# Altium schematic sheet EG8010.SchDoc: =DocumentName
size A4; CompanyName: "AS Manufacturing" LLC; Organization: "AS Manufacturing" LLC; Address1: 5 Sklyarenka St.; Address2: Kyiv 04073; Address3: Ukraine; Address4: https://ajax.systems/en/; SheetNumber: 1; SheetTotal: 1; Template_version: 1.0.1
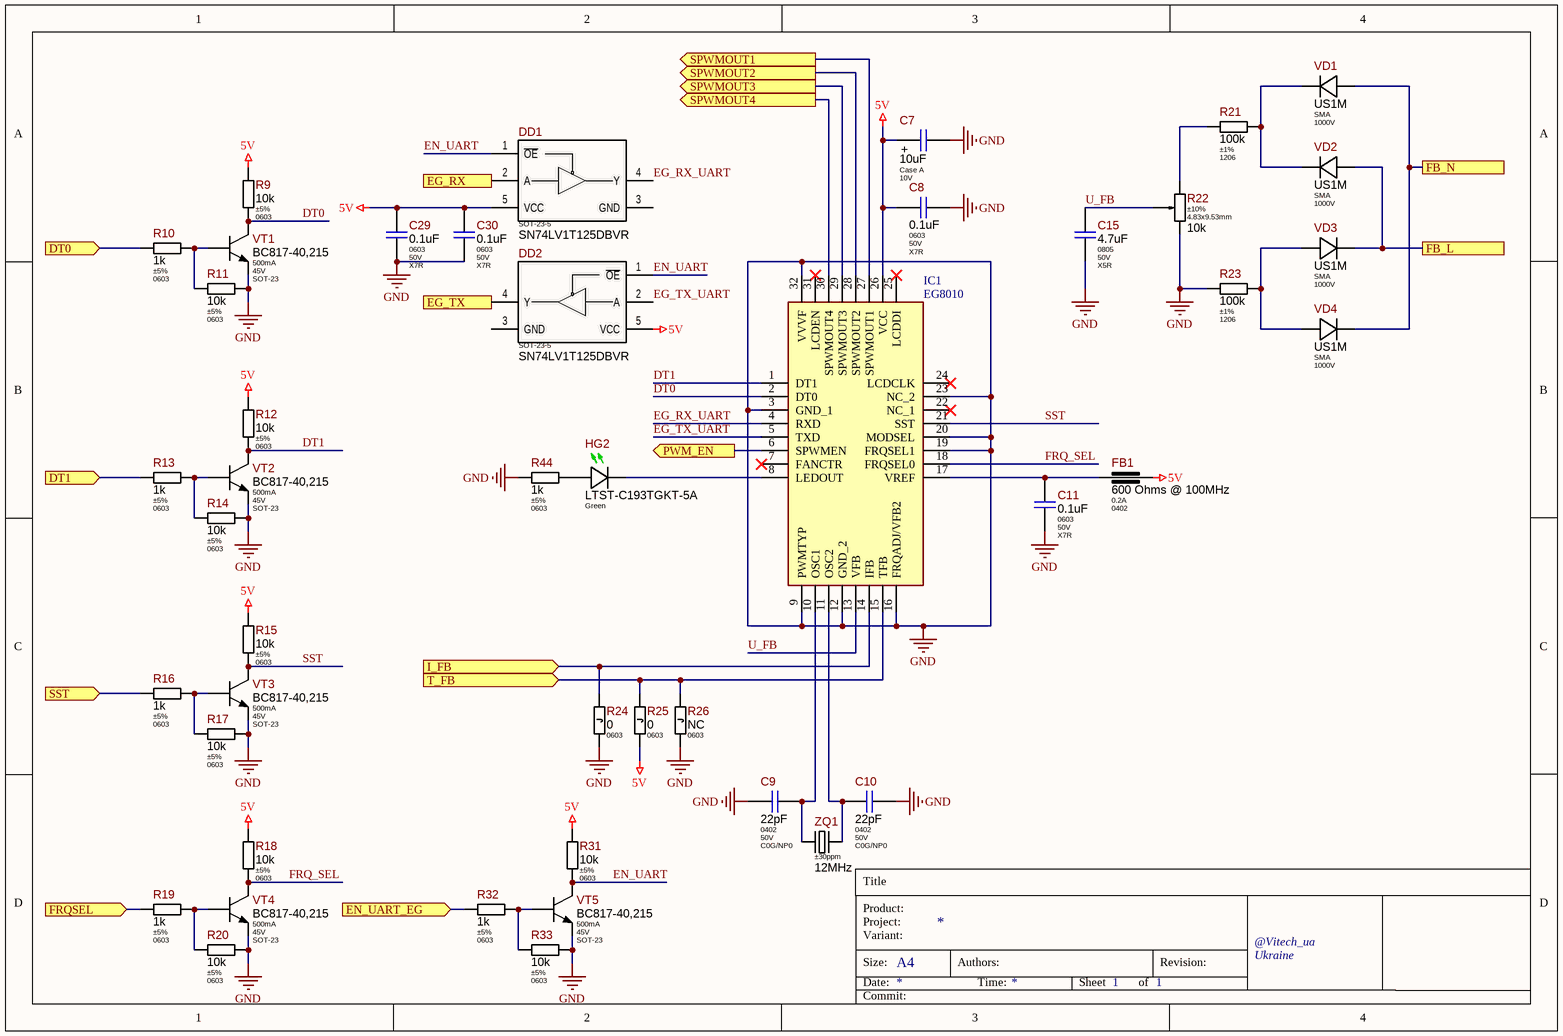
[diagram p0: EG8010.SchDoc]

## Parts
C7  Package: Case A  Voltage: 10V  [C_TANTAL_CASE_A_MED]  (hidden comment: 10uF)
C8  Package: 0603  Voltage: 50V  Dielectric Type: X7R  [C_CERAMIC_0603_MED]  (hidden comment: 0.1uF)
C9  Package: 0402  Voltage: 50V  Dielectric Type: C0G/NP0  [C_CERAMIC_0402_MED]  (hidden comment: 22pF)
C10  Package: 0402  Voltage: 50V  Dielectric Type: C0G/NP0  [C_CERAMIC_0402_MED]  (hidden comment: 22pF)
C11  Package: 0603  Voltage: 50V  Dielectric Type: X7R  [C_CERAMIC_0603_MED]  (hidden comment: 0.1uF)
C15  Package: 0805  Voltage: 50V  Dielectric Type: X5R  [C_CERAMIC_0805_MED]  (hidden comment: 4.7uF)
C29  Package: 0603  Voltage: 50V  Dielectric Type: X7R  [C_CERAMIC_0603_MED]  (hidden comment: 0.1uF)
C30  Package: 0603  Voltage: 50V  Dielectric Type: X7R  [C_CERAMIC_0603_MED]  (hidden comment: 0.1uF)
DD1  SN74LV1T125DBVR  [SOT-23-5]
DD2  SN74LV1T125DBVR  [SOT-23-5]
FB1  value 600 Ohms @ 100MHz  Current: 0.2A  Package: 0402  [BLM15xxxxxSN1x_MED]  (hidden comment: BLM15BD601SN1D)
HG2  Color: Green  [LTST-C193xGKT-5A]  (hidden comment: LTST-C193TGKT-5A)
IC1  EG8010  [QFP80P900X900X160-32N]
R9  Tolerance: ±5%  Package: 0603  [R_ANY_CHIP_0603_MED]  (hidden comment: 10k)
R10  Tolerance: ±5%  Package: 0603  [R_ANY_CHIP_0603_MED]  (hidden comment: 1k)
R11  Tolerance: ±5%  Package: 0603  [R_ANY_CHIP_0603_MED]  (hidden comment: 10k)
R12  Tolerance: ±5%  Package: 0603  [R_ANY_CHIP_0603_MED]  (hidden comment: 10k)
R13  Tolerance: ±5%  Package: 0603  [R_ANY_CHIP_0603_MED]  (hidden comment: 1k)
R14  Tolerance: ±5%  Package: 0603  [R_ANY_CHIP_0603_MED]  (hidden comment: 10k)
R15  Tolerance: ±5%  Package: 0603  [R_ANY_CHIP_0603_MED]  (hidden comment: 10k)
R16  Tolerance: ±5%  Package: 0603  [R_ANY_CHIP_0603_MED]  (hidden comment: 1k)
R17  Tolerance: ±5%  Package: 0603  [R_ANY_CHIP_0603_MED]  (hidden comment: 10k)
R18  Tolerance: ±5%  Package: 0603  [R_ANY_CHIP_0603_MED]  (hidden comment: 10k)
R19  Tolerance: ±5%  Package: 0603  [R_ANY_CHIP_0603_MED]  (hidden comment: 1k)
R20  Tolerance: ±5%  Package: 0603  [R_ANY_CHIP_0603_MED]  (hidden comment: 10k)
R21  Tolerance: ±1%  Package: 1206  [R_ANY_CHIP_1206_MED]  (hidden comment: 100k)
R22  Tolerance: ±10%  Package: 4.83x9.53mm  [3296W-1-xxx]  (hidden comment: 10k)
R23  Tolerance: ±1%  Package: 1206  [R_ANY_CHIP_1206_MED]  (hidden comment: 100k)
R24  Package: 0603  [R_ANY_CHIP_0603_MED]  (hidden comment: 0)
R25  Package: 0603  [R_ANY_CHIP_0603_MED]  (hidden comment: 0)
R26  Package: 0603  [R_ANY_CHIP_0603_MED]  (hidden comment: NC)
R31  Tolerance: ±5%  Package: 0603  [R_ANY_CHIP_0603_MED]  (hidden comment: 10k)
R32  Tolerance: ±5%  Package: 0603  [R_ANY_CHIP_0603_MED]  (hidden comment: 1k)
R33  Tolerance: ±5%  Package: 0603  [R_ANY_CHIP_0603_MED]  (hidden comment: 10k)
R44  Tolerance: ±5%  Package: 0603  [R_ANY_CHIP_0603_MED]  (hidden comment: 1k)
VD1  Package: SMA  Voltage: 1000V  [SMA_MED]  (hidden comment: US1M)
VD2  Package: SMA  Voltage: 1000V  [SMA_MED]  (hidden comment: US1M)
VD3  Package: SMA  Voltage: 1000V  [SMA_MED]  (hidden comment: US1M)
VD4  Package: SMA  Voltage: 1000V  [SMA_MED]  (hidden comment: US1M)
VT1  Ic: 500mA  Vce: 45V  Package: SOT-23  [SOT-23_MED]  (hidden comment: BC817-40,215)
VT2  Ic: 500mA  Vce: 45V  Package: SOT-23  [SOT-23_MED]  (hidden comment: BC817-40,215)
VT3  Ic: 500mA  Vce: 45V  Package: SOT-23  [SOT-23_MED]  (hidden comment: BC817-40,215)
VT4  Ic: 500mA  Vce: 45V  Package: SOT-23  [SOT-23_MED]  (hidden comment: BC817-40,215)
VT5  Ic: 500mA  Vce: 45V  Package: SOT-23  [SOT-23_MED]  (hidden comment: BC817-40,215)
ZQ1  Frequency Tolerance: ±30ppm  Frequency: 12MHz  [CSM4-Series]  (hidden comment: CSM4Z-A2B3C3-40-12.0D18)

## Ports
DT0 (in), DT1 (in), EG_RX (in), EG_TX (out), EN_UART_EG (in), FB_L, FB_N, FRQSEL (in), I_FB (in), PWM_EN (out), SPWMOUT1 (out), SPWMOUT2 (out), SPWMOUT3 (out), SPWMOUT4 (out), SST (in), T_FB (in)

## Nets
5V: C7.1 C8.1 C29.2 C30.2 DD1.5(VCC) DD2.5(VCC) FB1.1 IC1.26(VCC) R9.2 R12.2 R15.2 R18.2 R25.2 R31.2
GND: C7.2 C8.2 C9.1 C10.2 C11.2 C15.2 C29.1 C30.1 IC1.3(GND_1) IC1.9(PWMTYP) IC1.12(GND_2) IC1.16(FRQADJ/VFB2) IC1.19(FRQSEL1) IC1.20(MODSEL) IC1.23(NC_2) IC1.32(VVVF) R11.1 R14.1 R17.1 R20.1 R22.1(CCW) R23.1 R24.2 R26.2 R33.1 R44.1 VT1.2(E) VT2.2(E) VT3.2(E) VT4.2(E) VT5.2(E)
DT0: IC1.2(DT0) R9.1 VT1.3(C)
DT0: R10.1 ; port DT0  [a separate net that carries the same name]
DT1: IC1.1(DT1) R12.1 VT2.3(C)
DT1: R13.1 ; port DT1  [a separate net that carries the same name]
EG_RX: DD1.2(A) ; port EG_RX
EG_RX_UART: DD1.4(Y) IC1.4(RXD)
EG_TX: DD2.4(Y) ; port EG_TX
EG_TX_UART: DD2.2(A) IC1.5(TXD)
EN_UART: DD1.1(~{OE}) DD2.1(~{OE}) R31.1 VT5.3(C)
EN_UART_EG: R32.1 ; port EN_UART_EG
FB_L: VD2.AN VD3.CA ; port FB_L
FB_N: VD1.AN VD4.CA ; port FB_N
FRQ_SEL: IC1.18(FRQSEL0) R18.1 VT4.3(C)
FRQSEL: R19.1 ; port FRQSEL
I_FB: IC1.14(IFB) R24.1 ; port I_FB
PWM_EN: IC1.6(SPWMEN) ; port PWM_EN
SPWMOUT1: IC1.27(SPWMOUT1) ; port SPWMOUT1
SPWMOUT2: IC1.28(SPWMOUT2) ; port SPWMOUT2
SPWMOUT3: IC1.29(SPWMOUT3) ; port SPWMOUT3
SPWMOUT4: IC1.30(SPWMOUT4) ; port SPWMOUT4
SST: IC1.21(SST) R15.1 VT3.3(C)
SST: R16.1 ; port SST  [a separate net that carries the same name]
T_FB: IC1.15(TFB) R25.1 R26.1 ; port T_FB
U_FB: C15.1 IC1.13(VFB) R22.2(WIPER)
NetC9_2: C9.2 IC1.10(OSC1) ZQ1.2(XTAL2)
NetC10_1: C10.1 IC1.11(OSC2) ZQ1.1(XTAL1)
NetC11_1: C11.1 FB1.2 IC1.17(VREF)
NetHG2_AN: HG2.AN(Anode) R44.2
NetHG2_CA: HG2.CA(Cathode) IC1.8(LEDOUT)
NetR10_2: R10.2 R11.2 VT1.1(B)
NetR13_2: R13.2 R14.2 VT2.1(B)
NetR16_2: R16.2 R17.2 VT3.1(B)
NetR19_2: R19.2 R20.2 VT4.1(B)
NetR21_1: R21.1 R22.3(CW)
NetR21_2: R21.2 VD1.CA VD2.CA
NetR23_2: R23.2 VD3.AN VD4.AN
NetR32_2: R32.2 R33.2 VT5.1(B)

Not connected (* = marked no-connect by the designer): DD1 3(GND); DD2 3(GND); IC1 7(FANCTR)* 22(NC_1)* 24(LCDCLK)* 25(LCDDI)* 31(LCDEN)*

## Notes on the sheet
- Title
- Product:
- Project:
- Size:
- Date:
- Variant:
- A4
- Authors:
- Time:
- Sheet
- of
- Revision:
- @Vitech_ua
- Commit:
- (in symbol 293D106X9010A2TE3) +

## Library data of the parts
C7 = 293D106X9010A2TE3: 10uF 10V ±10% Case A Tantalum Capacitor RoHS, 3.4Ohm; Manufacturer: Vishay; Ajax_1C_ID: 58999; Ajax_1C_PN: 10uF 10V case A Vishay 293D106X9010A2TE3 Tantalum Capacitor SMD RoHS; Ajax_1С_Status: RND Only; Standard Lead Time: 20 Weeks; Component Status: Released; Dielectric Type: NONE; GUID_1C: 304cf5a9-8da3-11ed-a366-005056994834; Value: 10uF; Part Number: 293D106X9010A2TE3; Part Type: Tantalum; Component Type: SMD; Temperature Range: -55°C ~ 125°C; Tolerance: ±10%; ComponentLink1URL: https://eu.mouser.com/datasheet/2/427/293d-1763499.pdf; Supplier 1: Mouser; Supplier Part Number 1: 74-293D106X9010A2TE3; Replacement: NONE; Price: 0,1; ComponentLink1Description: Datasheet
C8 C11 C29 C30 = CL10B104KB8NNND: 100nF 50V X7R ±10% 0603 Ceramic Capacitor RoHS; Manufacturer: Samsung Electro-Mechanics; Ajax_1C_ID: 21313; Ajax_1C_PN: 100nF 50V X7R 10% 0603 CL10B104KB8NNND ceramic capacitor SMD; Ajax_1С_Status: Substitution; Standard Lead Time: 18 Weeks; Component Status: Released; Replacement: CL10B104KB8NNNC; GUID_1C: f1fd6399-ca68-11ea-ab63-0050569f2651; Value: 0.1uF; Part Number: CL10B104KB8NNND; Part Type: Ceramic / X7R / 0603; Component Type: SMD; Temperature Range: -55°C ~ 125°C; Tolerance: ±10%; ComponentLink1URL: https://media.digikey.com/pdf/Data%20Sheets/Samsung%20PDFs/CL_Series_MLCC_ds.pdf; Supplier 1: Digi-Key; Supplier Part Number 1: CL10B104KB8NNND-ND; Price: 0,0039378; ComponentLink1Description: Datasheet
C9 C10 = CL05C220JB5NNNC: 22pF 50V NP0, C0G ±5% 0402 Ceramic Capacitor RoHS; Manufacturer: Samsung Electro-Mechanics; Ajax_1C_ID: 26744; Ajax_1C_PN: 22pF 50V COG 5% 0402 Samsung CL05C220JB5NNNC Ceramic Capacitor SMD RoHS; Ajax_1С_Status: Substitution; Standard Lead Time: 22 Weeks; Component Status: Released; Replacement: NONE; GUID_1C: 5b73e2ce-71ce-11eb-ab70-0050569f2651; Value: 22pF; Part Number: CL05C220JB5NNNC; Part Type: Ceramic / C0G(NP0) / 0402; Component Type: SMD; Temperature Range: -55°C ~ 125°C; Tolerance: ±5%; ComponentLink1URL: https://media.digikey.com/pdf/Data%20Sheets/Samsung%20PDFs/CL_Series_MLCC_ds.pdf; Supplier 1: Digi-Key; Supplier Part Number 1: 1276-1116-2-ND; Price: 0,0034; ComponentLink1Description: Datasheet
C15 = GRM21BR61H475KE51L: 4.7uF 50V X5R ±10% 0805 Ceramic Capacitor RoHS; Manufacturer: Murata Electronics; Ajax_1C_ID: 10966; Ajax_1C_PN: 4.7uF 50V X5R 10% 0805 GRM21BR61H475KE51L/CL21A475KBQNNNE Ceramic Capacitor SMD RoHS; Ajax_1С_Status: Mass Production; Standard Lead Time: 15 Weeks; Component Status: Released; Replacement: NONE; GUID_1C: c30c0b00-b370-11e7-8189-14dda9d2d04d; Value: 4.7uF; Part Number: GRM21BR61H475KE51L; Part Type: Ceramic / X5R / 0805; Component Type: SMD; Temperature Range: -55°C ~ 85°C; Tolerance: ±10%; ComponentLink1URL: https://search.murata.co.jp/Ceramy/image/img/A01X/G101/ENG/GRM21BR61H475KE51-01.pdf; Supplier 1: Digi-Key; Supplier Part Number 1: 490-10751-2-ND; Price: 0,0396; ComponentLink1Description: Datasheet
DD1 DD2 = SN74LV1T125DBVR: Single Power Supply Single Buffer Gate with 3-State Output CMOS Logic Level Shifter, SOT-23-5; Manufacturer: Texas Instruments; Ajax_1C_ID: 37412; Ajax_1C_PN: SN74LV1T125DBVRG4 микросхема SOT-23-5 TI; Ajax_1С_Status: RND Only; Standard Lead Time: 35 Weeks; Component Status: On Review; Replacement: NONE; GUID_1C: 2979ae79-574b-11ec-a356-005056994834; Package: SOT-23-5; Part Number: SN74LV1T125DBVR; Part Type: Logic / Level Translator; Component Type: SMD; Temperature Range: -40°C ~ 125°C; ComponentLink1URL: https://www.ti.com/lit/ds/symlink/sn74lv1t125.pdf; Supplier 1: Digi-Key; Supplier Part Number 1: 296-37172-2-ND; Price: 0,386; ComponentLink1Description: Datasheet
FB1 = BLM15BD601SN1D: 600 Ohms @ 100MHz Power Line Ferrite Bead 0402, 200mA 650mOhm; Manufacturer: Murata Electronics; Ajax_1C_ID: 50383; Ajax_1C_PN: 600R BLM15BD601SN1D 0402 Murata Ferrite Bead; Ajax_1С_Status: RND Only; Saturation Current: NONE; Tolerance: ±25%; Component Status: Released; Standard Lead Time: 26 Weeks; GUID_1C: 598dd509-398f-11ed-a363-005056994834; Part Number: BLM15BD601SN1D; Part Type: Ferrite Bead; Component Type: SMD; Temperature Range: -55°C ~ 125°C; ComponentLink1URL: https://eu.mouser.com/datasheet/2/281/ENFA0018-1915754.pdf; Supplier 1: Mouser; Supplier Part Number 1: 81-BLM15BD601SN1D; Replacement: NONE; Price: 0,05; ComponentLink1Description: Datasheet
HG2 = LTST-C193TGKT-5A: Indication LED, Green 525nm, Clear, SMD 0603, Vf 2.5V - 3.1V, 28 ~ 280mcd @ 5 mA, 130°; Manufacturer: Lite-On Optoelectronics; Ajax_1C_ID: 10369; Ajax_1C_PN: LTST-C193TGKT-5A Green SMD LED 0603 12mcd 5mA 130deg RoHS pcs; Ajax_1С_Status: Mass Production; Component Status: Released; Replacement: NONE; GUID_1C: 4b87c4c2-6263-11e7-811b-14dda9d2d04d; Part Number: LTST-C193TGKT-5A; Part Type: LED / 0603; Component Type: SMD; Package: 0603; Wavelength: 525nm; Temperature Range: -20°C ~ 80°C; ComponentLink1URL: https://media.digikey.com/pdf/Data%20Sheets/Lite-On%20PDFs/LTST-C193TGKT-5A.pdf; Supplier 1: Digi-Key; Supplier Part Number 1: 160-1832-2-ND; Price: 0,10177143; ComponentLink1Description: Datasheet
IC1 = EG8010: Integrated Circuit; Manufacturer_Name: Glenair; Datasheet Link: https://datasheetspdf.com/pdf-file/729849/EGMicro/EG8010/1; Height: 1.6mm; Manufacturer_Part_Number: EG8010
R9 R11 R12 R14 R15 R17 R18 R20 R31 R33 = RC0603JR-0710KL: 10 kOhms ±5%, 1/10W 0603 Thick Film Resistor; Manufacturer: Yageo; Ajax_1C_ID: 2860; Ajax_1C_PN: 10k 5% 0603 Resistors SMD RoHS; Ajax_1С_Status: Mass Production; Power Rating: 0.1W; Voltage: 75V; Component Status: Released; Temperature Stability: ±100ppm/°C; Replacement: NONE; GUID_1C: df4c2852-e567-11e2-9779-6c626deda1bb; Value: 10k; Part Number: RC0603JR-0710KL; Component Type: SMD; Part Type: Thick Film; Temperature Range: -55°C ~ 155°C; ComponentLink1URL: https://eu.mouser.com/datasheet/2/447/PYu_RC_Group_51_RoHS_L_10-1664068.pdf; Supplier 1: Digi-Key; Supplier Part Number 1: 311-10KGRTR-ND; Price: 0,0006; ComponentLink1Description: Datasheet
R10 R13 R16 R19 R32 R44 = RC0603JR-071KL: 1 kOhms ±5%, 1/10W 0603 Thick Film Resistor; Manufacturer: Yageo; Ajax_1C_ID: 28124; Ajax_1C_PN: 1k 5% 0603 Resistors SMD RoHS; Ajax_1С_Status: Mass Production; Power Rating: 0.1W; Voltage: 75V; Component Status: Released; Temperature Stability: ±100ppm/°C; Replacement: NONE; GUID_1C: fbc5fd6b-8d66-11eb-ab70-0050569f2651; Value: 1k; Part Number: RC0603JR-071KL; Component Type: SMD; Part Type: Thick Film; Temperature Range: -55°C ~ 155°C; ComponentLink1URL: https://eu.mouser.com/datasheet/2/447/PYu_RC_Group_51_RoHS_L_11-1984063.pdf; Supplier 1: Digi-Key; Supplier Part Number 1: 311-1.0KGRTR-ND; Price: 0,00072; ComponentLink1Description: Datasheet
R21 R23 = RC1206FR-07100KL: 100 kOhms ±1%, 1/4W 1206 Thick Film Resistor; Manufacturer: Yageo; Ajax_1C_ID: 14373; Ajax_1C_PN: 100k 1% 1206 Resistors SMD RoHS; Ajax_1С_Status: Mass Production; Power Rating: 0.25W; Voltage: 200V; Component Status: Released; Temperature Stability: ±100ppm/°C; Replacement: NONE; GUID_1C: 93b23056-f3fc-11e8-ab4c-0050569f2651; Value: 100k; Part Number: RC1206FR-07100KL; Component Type: SMD; Part Type: Thick Film; Temperature Range: -55°C ~ 155°C; ComponentLink1URL: https://eu.mouser.com/datasheet/2/447/PYu_RC_Group_51_RoHS_L_10-1664068.pdf; Supplier 1: Digi-Key; Supplier Part Number 1: 311-100KFRTR-ND; Price: 0,00288; ComponentLink1Description: Datasheet
R22 = 3296W-1-103LF: 10 kOhms ±10% Trimmer Resistor, 0.5W, Through Hole 3/8", 4.83x9.53mm, 10.03mm Height; Manufacturer: Bourns; Ajax_1C_PN: NONE; Ajax_1С_Status: RND Only; Component Status: On Review; Temperature Stability: ±100ppm/°C; Value: 10k; Part Number: 3296W-1-103LF; Component Type: PTH; Part Type: Trimming Potentiometer; Power Rating: 0.5W; Temperature Range: -55°C ~ 125°C; ComponentLink1URL: https://www.bourns.com/data/global/pdfs/3296.pdf; Supplier 1: Mouser; Supplier Part Number 1: 652-3296W-1-103LF; Replacement: NONE; Price: NONE; ComponentLink1Description: Datasheet
R24-R26 = RC0603JR-070RL: 0 Ohms Jumper, 1/10W 0603 Thick Film Resistor; Manufacturer: Yageo; Tolerance: ±5%; Ajax_1C_ID: 2857; Ajax_1C_PN: 0R 5% 0603 Resistors SMD RoHS; Ajax_1С_Status: Mass Production; Power Rating: 0.1W; Voltage: 75V; Component Status: Released; Temperature Stability: NONE; GUID_1C: df4c284c-e567-11e2-9779-6c626deda1bb; Part Number: RC0603JR-070RL; Component Type: SMD; Part Type: Thick Film; Temperature Range: -55°C ~ 155°C; ComponentLink1URL: https://eu.mouser.com/datasheet/2/447/PYu_RC_Group_51_RoHS_L_10-1664068.pdf; Supplier 1: Digi-Key; Supplier Part Number 1: 311-0.0GRTR-ND; Replacement: NONE; Price: 0,0006; ComponentLink1Description: Datasheet
  R24 R25: Value: 0
  R26: Value: NC
VD1-VD4 = US1M: Diode Standard 1000V 1A, 75ns, SMA; Manufacturer: Diodec Semiconductor; Ajax_1C_ID: 20461; Ajax_1C_PN: US1M-DIO 1.0A 1000V 75ns, диод; Ajax_1С_Status: Mass Production; Component Status: Released; Vf: 1.7V @ 1A; Replacement: NONE; GUID_1C: 3d137b04-96a6-11ea-ab61-0050569f2651; Part Number: US1M; Part Type: General; Component Type: SMD; Marking: US1M; Current: 1A; Temperature Range: -50°C ~ 150°C; ComponentLink1URL: https://diotec.com/request/datasheet/us1a.pdf; Supplier 1: Arrow; Supplier Part Number 1: US1M; Price: 0,02875902; ComponentLink1Description: Datasheet
VT1-VT5 = BC817-40,215: 45V, 500mA NPN General Purpose Transistor; Manufacturer: Nexperia USA; Ajax_1C_ID: 6645; Ajax_1C_PN: BC817-40,215 : NPN, sot-23 транзистор; Ajax_1С_Status: Mass Production; Component Status: Released; Standard Lead Time: 4 Weeks; Replacement: NONE; GUID_1C: 5d499e81-0f64-11e5-ad28-a45d36c4a9e5; Part Number: BC817-40,215; Part Type: NPN; Component Type: SMD; Temperature Range: -65°C ~ 150°C; ComponentLink1URL: https://eu.mouser.com/datasheet/2/916/BC817_SER-1480622.pdf; Supplier 1: Mouser; Supplier Part Number 1: 771-BC817-40-T/R; Price: 0,094; ComponentLink1Description: Datasheet
ZQ1 = CSM4Z-A2B3C3-40-12.0D18: 12MHz, 18pF, ±30ppm, 40Ohm ESR, 1mW DL Crystal Quartz; Manufacturer: Cardinal Components Inc.; Ajax_1C_ID: 28125; Ajax_1C_PN: 12.000 MHz 30ppm 18pF CSM4Z-A2B3C3-40-12.0D18 кварцевый резонатор; Ajax_1С_Status: RND Only; Component Status: Released; Standard Lead Time: 8 Weeks; Replacement: NONE; GUID_1C: 0d925abc-8d67-11eb-ab70-0050569f2651; Part Number: CSM4Z-A2B3C3-40-12.0D18; Part Type: Crystal; Component Type: SMD; Load Capacitance: 18pF; Frequency Stability: ±30ppm; Temperature Range: -40°C ~ 85 °C; ComponentLink1URL: https://www.cardinalxtal.com/uploads/files/csm4-csm5.pdf; Supplier 1: Digi-Key; Supplier Part Number 1: 370-1146-2-ND; Price: 0,505; ComponentLink1Description: Datasheet